# Altium project DPfinal.PrjPcb
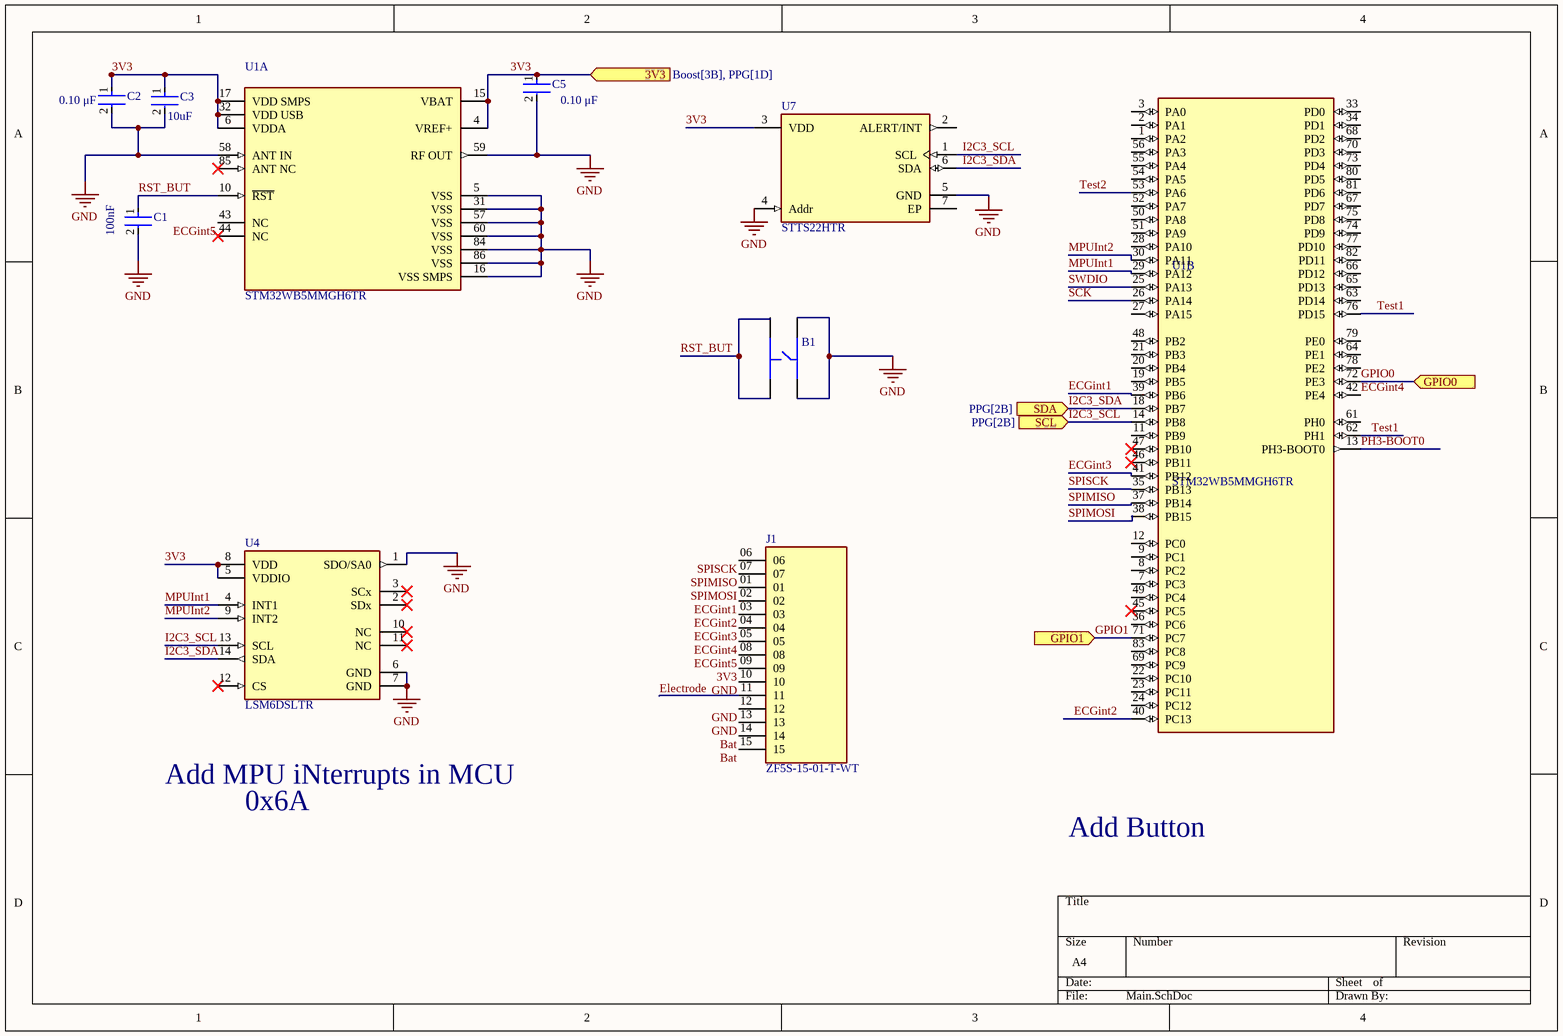
[diagram p0: Main.SchDoc]
3 sheets, 40 parts. Net scope: flat (ports and power ports of the same name join across sheets).
Board files: FinalPCB.PcbDoc, PCB1.PcbDoc
Sheets:
  Main.SchDoc
  PPG.SchDoc
  Boost.SchDoc

## Sheet Main.SchDoc
size A4; SheetNumber: 1; SheetTotal: 3

### Parts
B1  TS3425PA  [TS3425PA]  (value not drawn)
C1  value 100nF  [FP-GRM155-0_05-MFG]  (hidden comment: GRM155R71C104KA88J)
C2  Capacitance: 0.10 μF  [FP-C0402-BB-MFG]  (hidden comment: C0402C104K3RACTU)
C3  Capacitance: 10uF  [FP-CL10-IPC_A]  (hidden comment: CL10A106MA8NRNC)
C5  Capacitance: 0.10 μF  [FP-C0402-BB-MFG]  (hidden comment: C0402C104K3RACTU)
J1  ZF5S-15-01-T-WT  [ZF5S-15-01-T-WT]
U1  STM32WB5MMGH6TR  [STM32WB5MMGH6TR]  (parts A,B of 2)
U4  LSM6DSLTR  [FP-LGA-14L-DM00249496-MFG]
U7  STTS22HTR  [FP-UDFN-6L-DM00423052-MFG]

### Ports
3V3 (in, see Boost[3B], PPG[1D]), GPIO0 (in, see PPG[2C]), GPIO1 (in, see PPG[2C]), SCL (in, see PPG[2B]), SDA (in, see PPG[2B])

### Nets
GND: B1.3 B1.4 C1.2 C2.2 C3.2 C5.2 J1.10 J1.12 J1.13 U1.5(VSS) U1.16(VSS_SMPS) U1.31(VSS) U1.57(VSS) U1.58(ANT_IN) U1.59(RF_OUT) U1.60(VSS) U1.84(VSS) U1.86(VSS) U4.1(SDO/SA0) U4.6(GND) U4.7(GND) U7.4(Addr) U7.5(GND)
3V3: C2.1 C3.1 C5.1 J1.09 U1.4(VREF+) U1.6(VDDA) U1.15(VBAT) U1.17(VDD_SMPS) U1.32(VDD_USB) U4.5(VDDIO) U4.8(VDD) U7.3(VDD) ; port 3V3
Bat: J1.14 J1.15
ECGint1: J1.02 U1.39(PB6)
ECGint2: J1.03 U1.40(PC13)
ECGint3: J1.04 U1.41(PB12)
ECGint4: J1.05 U1.42(PE4)
ECGint5: J1.08 U1.43(NC)
Electrode: J1.11
GPIO0: U1.72(PE3) ; port GPIO0
GPIO1: U1.71(PC7) ; port GPIO1
I2C3_SCL: U1.14(PB8) U4.13(SCL) U7.1(SCL) ; port SCL
I2C3_SDA: U1.18(PB7) U4.14(SDA) U7.6(SDA) ; port SDA
MPUInt1: U1.29(PA12) U4.4(INT1)
MPUInt2: U1.30(PA11) U4.9(INT2)
PH3-BOOT0: U1.13(PH3-BOOT0)
RST_BUT: B1.1 C1.1 U1.10(~{RST})
SCK: U1.26(PA14)
SPIMISO: J1.07 U1.37(PB14)
SPIMOSI: J1.01
SPISCK: J1.06 U1.35(PB13)
SWDIO: U1.25(PA13)
Test1: U1.62(PH1) U1.76(PD15)
Test2: U1.53(PA6)

Not connected (* = marked no-connect by the designer): B1 2; U1 1(PA2) 2(PA1) 3(PA0) 7(PC3) 8(PC2) 9(PC1) 11(PB9) 12(PC0) 19(PB5) 20(PB4) 21(PB3) 22(PC10) 23(PC11) 24(PC12) 27(PA15) 28(PA10) 33(PD0) 34(PD1) 36(PC6) 38(PB15) 44(NC)* 45(PC5)* 46(PB11)* 47(PB10)* 48(PB2) 49(PC4) 50(PA8) 51(PA9) 52(PA7) 54(PA5) 55(PA4) 56(PA3) 61(PH0) 63(PD14) 64(PE1) 65(PD13) 66(PD12) 67(PD7) 68(PD2) 69(PC9) 70(PD3) 73(PD4) 74(PD9) 75(PD8) 77(PD10) 78(PE2) 79(PE0) 80(PD5) 81(PD6) 82(PD11) 83(PC8) 85(ANT_NC)*; U4 2(SDx)* 3(SCx)* 10(NC)* 11(NC)* 12(CS)*; U7 2(ALERT/INT) 7(EP)

### Notes on the sheet
- Add MPU iNterrupts in MCU
- 0x6A
- Add Button

### Library data of the parts
C1 = CMP-2008-03928-2: NexarPartId: 9223238; Manufacturer Lifecycle Status: NRND; Manufacturer: Murata; Voltage: 16V; Tolerance: 10%; Dielectric: X7R; Material: Ceramic; Schedule B: 8532240020, 8532240020; Mount: Surface Mount; Case/Package: 0402; Case Code (Imperial): 0402; Min Operating Temperature: -55°C; Length: 1mm; Voltage Rating (DC): 16V; Depth: 500µm; Lead Free: Lead Free; Max Operating Temperature: 125°C; Case Code (Metric): 1005; Radiation Hardening: No; Height: 550µm; Voltage Rating: 16V; Packaging: Cut Tape; RoHS: Compliant; Width: 500µm; Number of Pins: 2; REACH SVHC: No SVHC; Termination: SMD/SMT; Thickness: 500µm; Capacitance: 100nF; Supplier: Digikey; Supplier Part Number: 490-6328-1-ND; Manufacturer Part Number: GRM155R71C104KA88J; Category: Ceramic Capacitors; Stock: 17752595; Pricing: 1=0.08, 10=0.009, 50=0.0072, 100=0.0056, 500=0.0052, 1000=0.0048, 2500=0.004 (USD); Mounting Technology: Surface Mount; Pins: 2NUMBER; Package Quantity: 1; Series: GRM; Construction: Flat; Reach SVHC Compliant: No; RoHS Compliant: Yes; ComponentLink1URL: https://datasheet.ciiva.com/6271/product-6271168.pdf?src-supplier=Digikey; ComponentLink1Description: https://datasheet.ciiva.com/6271/product-6271168.pdf?src-supplier=Digikey; ComponentLink2URL: https://datasheet.ciiva.com/6271/grm155r71c104ka88-01-6271231.pdf?src-supplier=Digikey; ComponentLink2Description: https://datasheet.ciiva.com/6271/grm155r71c104ka88-01-6271231.pdf?src-supplier=Digikey
C2 C5 = CMP-03020-012858-1: Cap Ceramic 0.1uF 25V X7R 10% Pad SMD 0402 125C T/R; Manufacturer: Kemet; Value: 0.10 μF; Temperature Coefficient: 15%; Tolerance: 0.1; Dielectric Material: 4241ConductorMaterial; Temperature: -55°C to +125°C; Automotive: No; Height: 0.55mm; Package: C0402-BB; Category: Cap; Temperature Range Low: -55°C; Manufacturer Part Number: C0402C104K3RACTU; Device Class L2: Capacitors; Temperature Characteristic: X7R; Lead Free: Yes; Material: Ceramic; Mouser Description: Cap Ceramic 0.1uF 25V X7R 10% Pad SMD 0402 125C T/R; Temperature Range High: +125°C; Digikey Description: Cap Ceramic 0.1uF 25V X7R 10% Pad SMD 0402 125C T/R; Ipc Land Pattern Name: CAPC10050X50; Voltage Rating: 25 V; ComponentLink2URL: https://content.kemet.com/datasheets/KEM_C1002_X7R_SMD.pdf; Device Class L3: Ceramic Capacitors; RoHS: TRUE; Device Class L1: Passive Components; Octopart: https://octopart.com/c0402c104k3ractu-kemet-71105629; ComponentLink2Description: Datasheet; Supplier: Digikey; Supplier Part Number: 399-14148-1-ND; Stock: 453452; Pricing: 1=0.16, 10=0.095, 100=0.0611, 1000=0.04279, 2500=0.03794, 5000=0.0349 (USD); Case/Package: 0402; Pins: 2NUMBER; Case Code (Metric): 1005; Case Code (Imperial): 0402; Min Operating Temperature: -55°C; Max Operating Temperature: 125°C; Dielectric: X7R; Packaging: Cut Tape; Voltage Rating (DC): 25V; Reach SVHC Compliant: No; RoHS Compliant: Yes; ComponentLink1URL: http://www.farnell.com/datasheets/2746129.pdf?src-supplier=Farnell; ComponentLink1Description: http://www.farnell.com/datasheets/2746129.pdf?src-supplier=Farnell; ComponentLink3URL: http://www.farnell.com/datasheets/2746129.pdf?src-supplier=Newark; ComponentLink3Description: http://www.farnell.com/datasheets/2746129.pdf?src-supplier=Newark; ComponentLink4URL: http://www.farnell.com/datasheets/2746129.pdf?src-supplier=Element14; ComponentLink4Description: http://www.farnell.com/datasheets/2746129.pdf?src-supplier=Element14; ComponentLink5URL: https://datasheet.octopart.com/C0402C104K3RACTU-Kemet-datasheet-62095741.pdf?src-supplier=Element14; ComponentLink5Description: https://datasheet.octopart.com/C0402C104K3RACTU-Kemet-datasheet-62095741.pdf?src-supplier=Element14; ComponentLink6URL: https://api.kemet.com/component-edge/download/datasheet/C0402C104K3RAC7867.pdf?src-supplier=Digikey; ComponentLink6Description: https://api.kemet.com/component-edge/download/datasheet/C0402C104K3RAC7867.pdf?src-supplier=Digikey; ComponentLink7URL: https://datasheet.octopart.com/C0402C104K3RACTU-KEMET-datasheet-176289272.pdf?src-supplier=Newark; ComponentLink7Description: https://datasheet.octopart.com/C0402C104K3RACTU-KEMET-datasheet-176289272.pdf?src-supplier=Newark; ComponentLink8URL: https://datasheet.octopart.com/C0402C104K3RACTU-KEMET-datasheet-157246124.pdf?src-supplier=Electro+Sonic; ComponentLink8Description: https://datasheet.octopart.com/C0402C104K3RACTU-KEMET-datasheet-157246124.pdf?src-supplier=Electro+Sonic
C3 = CMP-13271-004224-1: Cap Ceramic 10uF 25V X5R ±20% Pad SMD 0603 +85°C T/R; Width: 0.031inch; Voltage Rating: 25V; Length: 0.063inch; Case Code (Metric): 1608; Dielectric: X5R; Termination: Wraparound; Lead Free: Lead Free; Mount: Surface Mount; Package Quantity: 1; Case Code (Imperial): 0603; Thickness: 0.035inch; Packaging: Tape and Reel; Contact Plating: Tin; Min Operating Temperature: -55°C; Tolerance: 20%; Max Operating Temperature: 85°C; Case/Package: 0603
J1 = ZF5S-15-01-T-WT: FFC & FPC Connectors Zero Insertion Force Connector for FFC, 0.50 mm (.0197) Pitch; Manufacturer: Samtec; Actuator Material: Polymer,Liquid Crystal Polymer; Actuator Color: Black; Wire/Cable Type: Straight; Number of Positions: 15; Max Current Rating: 1.4A; Pitch: 0.5mm; Supplier: Digikey; Supplier Part Number: SAM10388-ND; Manufacturer Part Number: ZF5S-15-01-T-WT; RoHS: Yes; Category: FFC / FPC; Stock: 265; Pricing: 1=2.37, 50=1.93, 100=1.64, 500=1.46, 1000=1.2763 (USD); Mounting Technology: Surface Mount; Contact Material: Bronze; Contact Plating: Tin; Housing Color: Natural; Housing Material: Polymer; Min Operating Temperature: -55°C; Max Operating Temperature: 105°C; Packaging: Rail/Tube; Termination: Solder; Series: ZF5S; Number of Rows: 1; Number of Contacts: 15; Orientation: Right Angle; Length: 13.15mm; Depth: 5.66mm; Radiation Hardening: No; RoHS Compliant: Yes; ComponentLink1URL: http://www.farnell.com/datasheets/2607237.pdf?src-supplier=Farnell; ComponentLink1Description: http://www.farnell.com/datasheets/2607237.pdf?src-supplier=Farnell; ComponentLink2URL: http://components.arrow.com/part/dataview/51417210S9388675N1004?src-supplier=Arrow+Electronics; ComponentLink2Description: http://components.arrow.com/part/dataview/51417210S9388675N1004?src-supplier=Arrow+Electronics; ComponentLink3URL: http://www.farnell.com/datasheets/2607237.pdf?src-supplier=Newark; ComponentLink3Description: http://www.farnell.com/datasheets/2607237.pdf?src-supplier=Newark; ComponentLink4URL: http://www.samtec.com/documents/webfiles/pdf/zf5s.pdf?src-supplier=Avnet; ComponentLink4Description: http://www.samtec.com/documents/webfiles/pdf/zf5s.pdf?src-supplier=Avnet; ComponentLink5URL: http://suddendocs.samtec.com/prints/zf5s-xx-xx-x-wt-x-xx-mkt.pdf?src-supplier=Digikey; ComponentLink5Description: http://suddendocs.samtec.com/prints/zf5s-xx-xx-x-wt-x-xx-mkt.pdf?src-supplier=Digikey; Supplier 1: Digikey; Supplier Part Number 1: SAM10388-ND
U1 = STM32WB5MMGH6TR: RISC Microcontroller, 32-Bit, FLASH, CORTEX-M4F CPU, 180MHz, CMOS, PBGA216; Manufacturer: STMicroelectronics; Interface: 39,40,224,1519,1532,1533,4268Interface; Data Rate: 2Mbps; Clock Frequency: 2.4GHz; Max Supply Voltage: 3.6V; Min Supply Voltage: 1.71V; Number of GPIO: 68NUMBER; Supplier: Digikey; Supplier Part Number: 497-STM32WB5MMGH6CT-ND; Manufacturer Part Number: STM32WB5MMGH6TR; RoHS: No; Category: Microcontrollers; Stock: 5514; Pricing: 1=12.14, 10=9.532, 25=8.8804, 100=8.1641, 250=7.8228, 500=7.61702 (USD); Min Operating Temperature: -40°C; Max Operating Temperature: 85°C; Height: 1.428mm; Supplier 1: Digikey; Supplier Part Number 1: 497-STM32WB5MMGH6CT-ND
U4 = CMP-2000-07467-2: IMU ACCEL/GYRO I2C/SPI 14LGA; Manufacturer: STMicroelectronics; Resolution: 16bits; Max Supply Voltage: 3.6V; Sensor Type: Temperature,Accelerometer,Gyroscope; Sensor Output: I2C,SPI; Gyro Range: 125/250/500/1000/2000°/s; Accel Range: 2/4/8/16g; Operating Supply Current: 0.29-0.65mA; Min Supply Voltage: 1.62V; Package: LGA-14L-DM00249496; Temperature Range High: +85°C; Automotive: No; Footprint Url: https://www.st.com/resource/en/technical_note/cd00134799.pdf; Height: 0.86mm; Device Class L1: Sensors; Octopart: https://octopart.com/lsm6dsltr-stmicroelectronics-66358193; Device Class L2: Motion Sensors; Lead Free: Yes; Category: IC; Device Class L3: Inertial Measurement Units (IMUs); ComponentLink2Description: Datasheet; RoHS: TRUE; ComponentLink2URL: https://www.st.com/resource/en/datasheet/lsm6dsl.pdf; Temperature Range Low: -40°C; Manufacturer Part Number: LSM6DSLTR; Mouser Description: iNEMO inertial module: always-on 3D accelerometer and 3D gyroscope; Digikey Description: IMU ACCEL/GYRO I2C/SPI 14LGA; Temperature: -40°C to +85°C
U7 = CMP-12184-000002-1: LOW-VOLTAGE, ULTRA-LOW-POWER, 0.; Manufacturer: STMicroelectronics; Max Supply Voltage: 3.6V; Sensor Output: I2C,SMBus; Min Supply Voltage: 1.5V; Resolution: 16bits; Standoff Height: 0mm; Operating Supply Current: 1.75-120uA; Octopart: https://octopart.com/stts22htr-stmicroelectronics-103417944; Temperature: -40°C to +125°C; Interface: I2C,SMBus; ComponentLink2Description: Datasheet; Device Class L3: unset; Lead Free: Yes; Temperature Range Low: -40°C; ComponentLink2URL: https://www.st.com/resource/en/datasheet/stts22h.pdf; Temperature Range High: +125°C; RoHS: TRUE; Automotive: No; Device Class L1: Sensors; Category: IC; Manufacturer Part Number: STTS22HTR; Package: UDFN-6L-DM00423052; Device Class L2: Temperature and Humidity Sensors; Mouser Description: Low-voltage, ultra-low-power, 0.5 ï¿½C accuracy Iï¿½C/SMBus 3.0 temperature sensor; Digikey Description: LOW-VOLTAGE, ULTRA-LOW-POWER, 0.; Height: 0.55mm

## Sheet PPG.SchDoc
size A4; SheetNumber: 2; SheetTotal: 3; SPICEModelCacheSGABUIPG: <root> / <DocumentId>SGABUIPG</DocumentId> / </root>
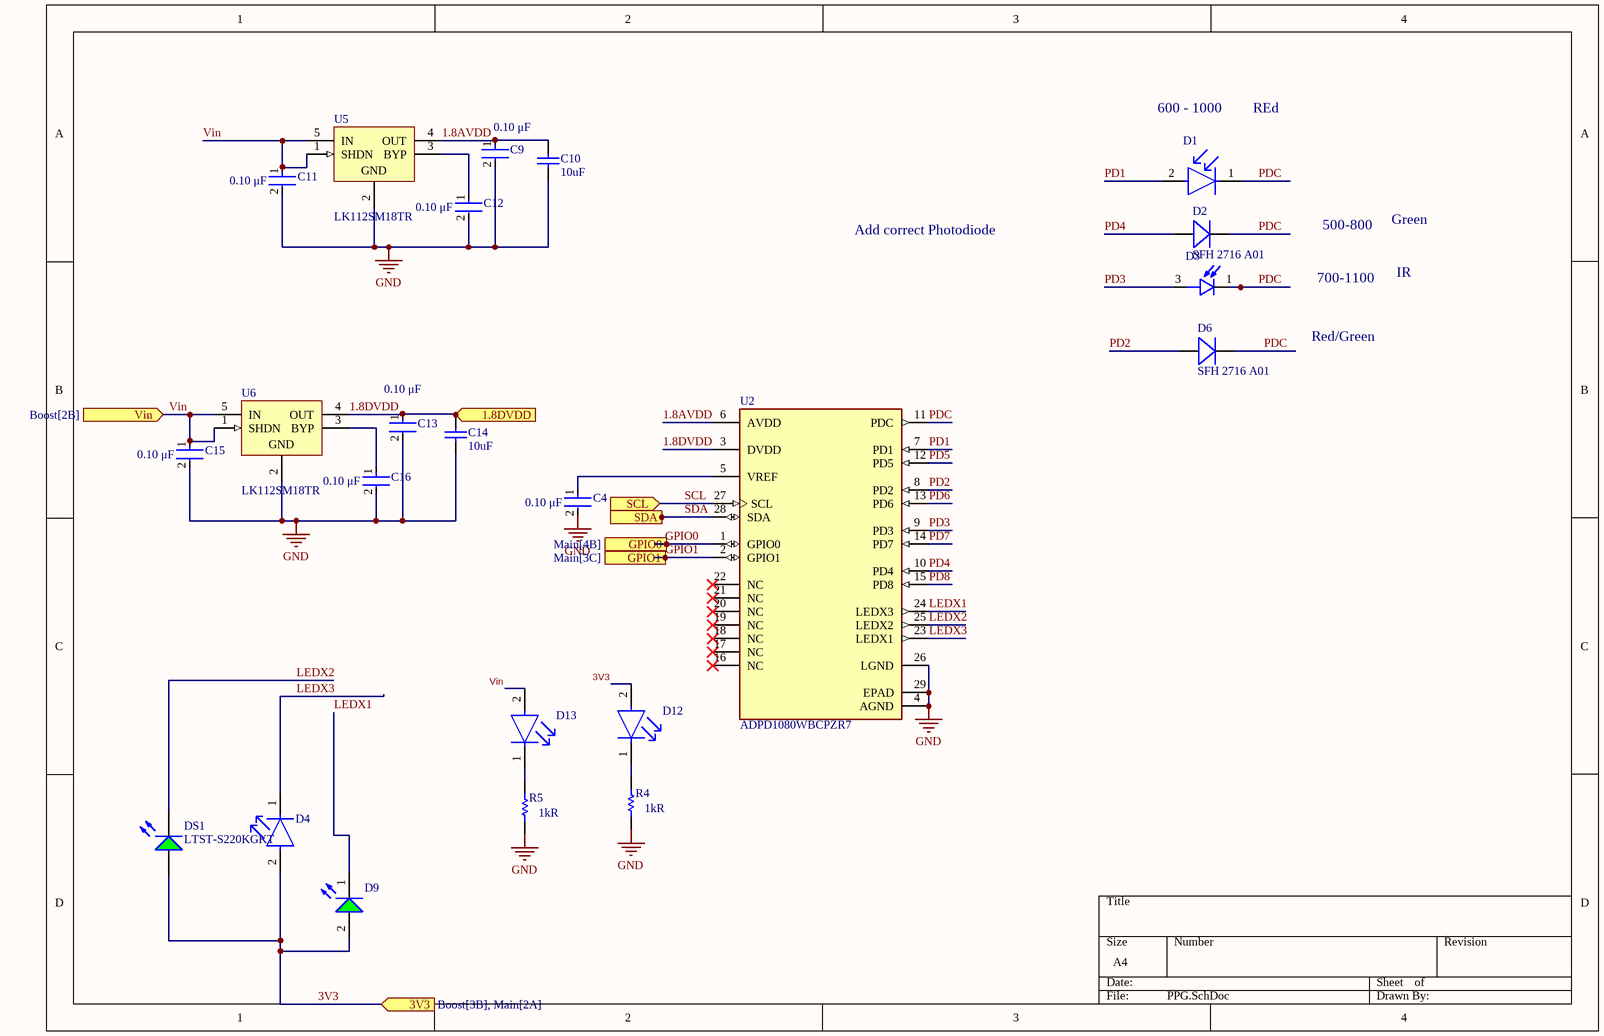
[diagram p1: PPG.SchDoc]

### Parts
C4  Capacitance: 0.10 μF  [FP-C0402-BB-MFG]  (hidden comment: C0402C104K3RACTU)
C9  Capacitance: 0.10 μF  [FP-C0402-BB-MFG]  (hidden comment: C0402C104K3RACTU)
C10  value 10uF  (hidden comment: Capacitor)
C11  Capacitance: 0.10 μF  [FP-C0402-BB-MFG]  (hidden comment: C0402C104K3RACTU)
C12  Capacitance: 0.10 μF  [FP-C0402-BB-MFG]  (hidden comment: C0402C104K3RACTU)
C13  Capacitance: 0.10 μF  [FP-C0402-BB-MFG]  (hidden comment: C0402C104K3RACTU)
C14  value 10uF  (hidden comment: Capacitor)
C15  Capacitance: 0.10 μF  [FP-C0402-BB-MFG]  (hidden comment: C0402C104K3RACTU)
C16  Capacitance: 0.10 μF  [FP-C0402-BB-MFG]  (hidden comment: C0402C104K3RACTU)
D1  SFH 2704  [FP-SFH_2704-MFG]  (value not drawn)
D2  SFH 2716 A01  [SFH 2716 A01]
D3  SFH 2400 FA  [SFH 2400 FA]  (value not drawn)
D4  LS R976-NR-1  [FP-LS_R976-MFG]  (value not drawn)
D6  SFH 2716 A01  [SFH 2716 A01]
D9  150141GS73100  [WL-SMTW_3528]  (value not drawn)
D12  LTST-S270KRKT  [FP-LTST-S270KRKT-MFG]  (value not drawn)
D13  LTST-S270KRKT  [FP-LTST-S270KRKT-MFG]  (value not drawn)
DS1  LTST-S220KGKT  [LTST-S220KGKT_V]
R4  value 1kR  [RESC1005X40X25LL10T10]  (hidden comment: RK73H1ETTP1001F)
R5  value 1kR  [RESC1005X40X25LL10T10]  (hidden comment: RK73H1ETTP1001F)
U2  ADPD1080WBCPZR7  [ADPD1080WBCPZR7]
U5  LK112SM18TR  [SOT23-5L_M]
U6  LK112SM18TR  [SOT23-5L_M]

### Ports
1.8DVDD (in), 3V3 (in, see Boost[3B], Main[2A]), GPIO0 (in, see Main[4B]), GPIO1 (in, see Main[3C]), SCL (in, see Main[3B]), SDA (in, see Main[3B]), Vin (in, see Boost[2B])

### Nets
GND: C4.2 C9.2 C10.1 C11.2 C12.2 C13.2 C14.1 C15.2 C16.2 R4.1 R5.1 U2.4(AGND) U2.26(LGND) U2.29(EPAD) U5.2(GND) U6.2(GND)
1.8AVDD: C9.1 C10.2 U2.6(AVDD) U5.4(OUT)
1.8DVDD: C13.1 C14.2 U2.3(DVDD) U6.4(OUT) ; port 1.8DVDD
3V3: D4.2(A) D9.2(A) D12.2(A) DS1.1(A) ; port 3V3
GPIO0: U2.1(GPIO0) ; port GPIO0
GPIO1: U2.2(GPIO1) ; port GPIO1
LEDX1: D9.1(K) U2.24(LEDX3)
LEDX2: DS1.2(K) U2.25(LEDX2)
LEDX3: D4.1(C) U2.23(LEDX1)
PD1: D1.2(A) U2.7(PD1)
PD2: D6.A U2.8(PD2)
PD3: D3.3(A) U2.9(PD3)
PD4: D2.A U2.10(PD4)
PD5: U2.12(PD5)
PD6: U2.13(PD6)
PD7: U2.14(PD7)
PD8: U2.15(PD8)
PDC: D1.1(C) D2.K D3.1(C) D6.K U2.11(PDC)
SCL: U2.27(SCL) ; port SCL  [project net I2C3_SCL]
SDA: U2.28(SDA) ; port SDA  [project net I2C3_SDA]
Vin: C11.1 C15.1 D13.2(A) U5.1(SHDN) U5.5(IN) U6.1(SHDN) U6.5(IN) ; port Vin
NetC4_1: C4.1 U2.5(VREF)
NetC12_1: C12.1 U5.3(BYP)
NetC16_1: C16.1 U6.3(BYP)
NetD12_1: D12.1(C) R4.2
NetD13_1: D13.1(C) R5.2

Not connected (* = marked no-connect by the designer): U2 16(NC)* 17(NC)* 18(NC)* 19(NC)* 20(NC)* 21(NC)* 22(NC)*

### Notes on the sheet
- 600 - 1000
- REd
- Add correct Photodiode
- 500-800
- Green
- 700-1100
- IR
- Red/Green

### Library data of the parts
C4 C9 C11-C13 C15 C16 = CMP-03020-012858-1: as C2 on sheet Main; Temperature: -55°C to +125°C; Automotive: No; Height: 0.55mm; Package: C0402-BB; Category: Cap; Temperature Range Low: -55°C; Manufacturer Part Number: C0402C104K3RACTU; Device Class L2: Capacitors; Temperature Characteristic: X7R; Lead Free: Yes; Material: Ceramic; Mouser Description: Cap Ceramic 0.1uF 25V X7R 10% Pad SMD 0402 125C T/R; Temperature Range High: +125°C; Digikey Description: Cap Ceramic 0.1uF 25V X7R 10% Pad SMD 0402 125C T/R; Ipc Land Pattern Name: CAPC10050X50; Voltage Rating: 25 V; ComponentLink2URL: https://content.kemet.com/datasheets/KEM_C1002_X7R_SMD.pdf; Device Class L3: Ceramic Capacitors; RoHS: TRUE; Device Class L1: Passive Components; Octopart: https://octopart.com/c0402c104k3ractu-kemet-71105629; ComponentLink2Description: Datasheet; Supplier: Digikey; Supplier Part Number: 399-14148-1-ND; Stock: 453452; Pricing: 1=0.16, 10=0.095, 100=0.0611, 1000=0.04279, 2500=0.03794, 5000=0.0349 (USD); Case/Package: 0402; Pins: 2NUMBER; Case Code (Metric): 1005; Case Code (Imperial): 0402; Min Operating Temperature: -55°C; Max Operating Temperature: 125°C; Dielectric: X7R; Packaging: Cut Tape; Voltage Rating (DC): 25V; Reach SVHC Compliant: No; RoHS Compliant: Yes; ComponentLink1URL: http://www.farnell.com/datasheets/2746129.pdf?src-supplier=Farnell; ComponentLink1Description: http://www.farnell.com/datasheets/2746129.pdf?src-supplier=Farnell; ComponentLink3URL: http://www.farnell.com/datasheets/2746129.pdf?src-supplier=Newark; ComponentLink3Description: http://www.farnell.com/datasheets/2746129.pdf?src-supplier=Newark; ComponentLink4URL: http://www.farnell.com/datasheets/2746129.pdf?src-supplier=Element14; ComponentLink4Description: http://www.farnell.com/datasheets/2746129.pdf?src-supplier=Element14; ComponentLink5URL: https://datasheet.octopart.com/C0402C104K3RACTU-Kemet-datasheet-62095741.pdf?src-supplier=Element14; ComponentLink5Description: https://datasheet.octopart.com/C0402C104K3RACTU-Kemet-datasheet-62095741.pdf?src-supplier=Element14; ComponentLink6URL: https://api.kemet.com/component-edge/download/datasheet/C0402C104K3RAC7867.pdf?src-supplier=Digikey; ComponentLink6Description: https://api.kemet.com/component-edge/download/datasheet/C0402C104K3RAC7867.pdf?src-supplier=Digikey; ComponentLink7URL: https://datasheet.octopart.com/C0402C104K3RACTU-KEMET-datasheet-176289272.pdf?src-supplier=Newark; ComponentLink7Description: https://datasheet.octopart.com/C0402C104K3RACTU-KEMET-datasheet-176289272.pdf?src-supplier=Newark; ComponentLink8URL: https://datasheet.octopart.com/C0402C104K3RACTU-KEMET-datasheet-157246124.pdf?src-supplier=Electro+Sonic; ComponentLink8Description: https://datasheet.octopart.com/C0402C104K3RACTU-KEMET-datasheet-157246124.pdf?src-supplier=Electro+Sonic
C10 C14 = Capacitor: CL10 Series 0603 10 uF 16 V ±20% Tolerance X5R Multilayer Ceramic Chip Capacitor; Manufacturer: Samsung; Manufacturer Part Number: CL10A106MO8NQNC; SimulationGenericComponent: True; Supplier: Mouser; Supplier Part Number: 187-CL10A106MO8NQNC; RoHS: Yes; Category: Ceramic Capacitors; Stock: 15386; Pricing: 1=0.3, 10=0.167, 50=0.167, 100=0.098, 1000=0.066, 10000=0.047 (USD); Lead Free: 5697LeadFree; ComponentLink1URL: https://datasheet.ciiva.com/25711/cl10a106mo8nqnc-25711536.pdf?src-supplier=Digikey; ComponentLink1Description: https://datasheet.ciiva.com/25711/cl10a106mo8nqnc-25711536.pdf?src-supplier=Digikey; ComponentLink2URL: https://datasheet.ciiva.com/26838/getdatasheetpartid-746571-26838345.pdf?src-supplier=Verical; ComponentLink2Description: https://datasheet.ciiva.com/26838/getdatasheetpartid-746571-26838345.pdf?src-supplier=Verical; ComponentLink3URL: https://datasheet.ciiva.com/29198/457342-da-01-en-vs-kondensator-0603-29198787.pdf?src-supplier=Conrad; ComponentLink3Description: https://datasheet.ciiva.com/29198/457342-da-01-en-vs-kondensator-0603-29198787.pdf?src-supplier=Conrad
D1 = CMP-62027-000006-1: SENSOR PHOTODIODE 900NM 2SMD; Manufacturer: Osram Opto; Viewing Angle: 120°; Dark Current: 100pA; Diode Type: PIN; Response Time: 67ns; Max Reverse Voltage (DC): 6V; RoHS Compliant: Yes; Supplier: Digikey; Supplier Part Number: 475-SFH2704CT-ND; Manufacturer Part Number: SFH 2704; RoHS: Yes; Category: Photodiodes; Stock: 4566; Pricing: 1=0.83, 10=0.576, 100=0.4218, 500=0.35302, 1000=0.33048 (USD); Mounting Technology: Surface Mount; Case/Package: SMD/SMT; Min Operating Temperature: -40°C; Max Operating Temperature: 85°C; Series: CHipLED; Packaging: Cut Tape; Wavelength: 900nm; ComponentLink1URL: https://media.digikey.com/pdf/Data%20Sheets/Osram%20PDFs/SFH_2704_v0.0_9-12-18.pdf?src-supplier=Digikey; ComponentLink1Description: https://media.digikey.com/pdf/Data%20Sheets/Osram%20PDFs/SFH_2704_v0.0_9-12-18.pdf?src-supplier=Digikey; ComponentLink2URL: http://datasheet.octopart.com/SFH-2704-Osram-Opto-datasheet-142374394.pdf?src-supplier=Rs; ComponentLink2Description: http://datasheet.octopart.com/SFH-2704-Osram-Opto-datasheet-142374394.pdf?src-supplier=Rs
D2 D6 = SFH 2716 A01: Silicon PIN Photodiode with Vλ Characteristics, -40 to 100 °C, 1.3 x 2 x 0.8 mm; Manufacturer: Osram Opto; Supplier: DigiKey; Supplier Part Number: 475-SFH2716A01CT-ND; Manufacturer Part Number: SFH 2716 A01; RoHS: Yes; Category: Phototransistor; Stock: 7067; Pricing: 1=1.01, 10=0.615, 100=0.4162, 500=0.33804, 1000=0.31406 (USD); Supplier 1: Digikey; Supplier Part Number 1: 475-SFH2716A01DKR-ND
D4 = CMP-62016-000037-1: LED RED DIFFUSED 0805 SMD; Lens Size: 1.25mm; Number of LEDs: 1; Luminous Intensity: 180mcd; Dominant Wavelength: 633nm; Lens Style: Flat; Reverse Voltage: 12V; Lens Color: White; Forward Voltage: 2.5V; Forward Current: 25mA; Power Dissipation: 65W; Luminous Flux: 0.47lm; Test Current: 20mA; Viewing Angle: 160°; Length: 2mm; Number of Pins: 2; Lens Transparency: Diffused; Min Operating Temperature: -30°C; Case Code (Metric): 2012; Depth: 1.35mm; Color: Red; Illumination Color: Red; Max Operating Temperature: 85°C; Mount: Surface Mount; Case/Package: 0805; Height: 0.9mm; Package Quantity: 16000; Number of Elements: 1; Radiation Hardening: No; Case Code (Imperial): 0805; Packaging: Tape and Reel; Width: 1.25mm
D9 = CMP-1429-00004-2: NexarPartId: 29717794; Manufacturer: Wurth Electronics; Forward Current: 100mA; Lens Style: Clear, Round; Color: Green; Wavelength: 525nm; Peak Wavelength: 515nm; Luminous Intensity: 1cd; Forward Voltage: 3.1V; Viewing Angle: 120°; Test Current: 20mA; Max Reverse Voltage (DC): 5V; Power Dissipation: 105mW; Lens Color: Colorless; Lens Transparency: Clear; Lens Size: 2.4mm; Mount: Surface Mount; Max Operating Temperature: 85°C; Min Operating Temperature: -40°C; Lead Free: Lead Free; Width: 2.8mm; Case Code (Imperial): 1411; REACH SVHC: Unknown; RoHS: Compliant; Packaging: Tape and Reel; Length: 3.5mm; Dominant Wavelength: 525nm; Height: 1.9mm; Case/Package: 3528; Reverse Voltage: 5V; Case Code (Metric): 3528; Supplier: Digikey; Supplier Part Number: 732-4997-1-ND; Manufacturer Part Number: 150141GS73100; Category: LEDs; Stock: 36143; Pricing: 1=0.17, 50=0.1684, 100=0.1467, 500=0.115 (USD); Mounting Technology: Surface Mount; Package Quantity: 1; Series: WL-SMTW; RoHS Compliant: Yes; Reach SVHC Compliant: Unknown; ComponentLink1URL: https://datasheet.ciiva.com/23843/150141gs73100-23843266.pdf?src-supplier=Newark; ComponentLink1Description: https://datasheet.ciiva.com/23843/150141gs73100-23843266.pdf?src-supplier=Newark; ComponentLink2URL: https://datasheet.ciiva.com/29278/759463-da-01-en-smd-topled-einf-gruen-150141gs73100-29278953.pdf?src-supplier=Conrad; ComponentLink2Description: https://datasheet.ciiva.com/29278/759463-da-01-en-smd-topled-einf-gruen-150141gs73100-29278953.pdf?src-supplier=Conrad; ComponentLink3URL: https://datasheet.ciiva.com/22656/1911484-22656997.pdf?src-supplier=Element14; ComponentLink3Description: https://datasheet.ciiva.com/22656/1911484-22656997.pdf?src-supplier=Element14; ComponentLink4URL: https://datasheet.ciiva.com/48430/150141gs73100-eng-tds-48430060.pdf?src-supplier=Distrelec; ComponentLink4Description: https://datasheet.ciiva.com/48430/150141gs73100-eng-tds-48430060.pdf?src-supplier=Distrelec; ComponentLink5URL: https://datasheet.ciiva.com/29563/150141gs73100-29563029.pdf?src-supplier=Digikey; ComponentLink5Description: https://datasheet.ciiva.com/29563/150141gs73100-29563029.pdf?src-supplier=Digikey; ComponentLink6URL: https://datasheet.ciiva.com/29563/150141gs73100-29563030.pdf?src-supplier=Digikey; ComponentLink6Description: https://datasheet.ciiva.com/29563/150141gs73100-29563030.pdf?src-supplier=Digikey
D12 D13 = CMP-2000-06630-2: LED RED CLEAR CHIP SMD R/A; Manufacturer: Vishay Lite-On; Test Current: 20mA; Number of LEDs: 1; Power Rating: 75mW; Lens Style: Diffused; Luminous Intensity: 54mcd; Wavelength: 639nm; Dominant Wavelength: 631nm; Lens Color: Colorless; Forward Voltage: 2V; Viewing Angle: 130°; Forward Current: 30mA; Reverse Voltage: 5V; Lens Size: 0.6mm; Illumination Color: Red; Case Code (Imperial): 0603; Color: Red; Packaging: Tape and Reel; Number of Pins: 2; Length: 1.6mm; Lens Transparency: Clear; Width: 1.15mm; Power Dissipation: 75mW; Lead Free: Lead Free; Max Power Dissipation: 75mW; Case/Package: 0603; Max Operating Temperature: 85°C; Mount: Surface Mount; Depth: 0.6mm; Number of Elements: 1; Radiation Hardening: No; Case Code (Metric): 1608; Package Quantity: 1; Height: 0.6mm; Min Operating Temperature: -55°C; Supplier: Digikey; Supplier Part Number: 160-1479-1-ND; Manufacturer Part Number: LTST-S270KRKT; RoHS: Yes; Category: LEDs; Stock: 83540; Pricing: 1=0.24, 10=0.133, 100=0.0617, 500=0.05696, 1000=0.04462, 2000=0.04367 (USD); Mounting Technology: Surface Mount; Pins: 2; Series: -; RoHS Compliant: Yes; ComponentLink1URL: https://datasheet.ciiva.com/11775/0900766b80dc0b8e-11775445.pdf?src-supplier=Rs; ComponentLink1Description: https://datasheet.ciiva.com/11775/0900766b80dc0b8e-11775445.pdf?src-supplier=Rs; ComponentLink2URL: https://datasheet.ciiva.com/12400/ltst-s270krkt-201849-12400833.pdf?src-supplier=Mouser; ComponentLink2Description: https://datasheet.ciiva.com/12400/ltst-s270krkt-201849-12400833.pdf?src-supplier=Mouser; ComponentLink3URL: https://datasheet.ciiva.com/2110/ltst-s270krkt-2110021.pdf?src-supplier=Digikey; ComponentLink3Description: https://datasheet.ciiva.com/2110/ltst-s270krkt-2110021.pdf?src-supplier=Digikey; ComponentLink4URL: https://datasheet.ciiva.com/16387/p-100-ltst-s270krkt-16387507.pdf?src-supplier=Future+Electronics; ComponentLink4Description: https://datasheet.ciiva.com/16387/p-100-ltst-s270krkt-16387507.pdf?src-supplier=Future+Electronics; ComponentLink5URL: https://datasheet.ciiva.com/2110/s-110-ltst-s270krkt-2110023.pdf?src-supplier=Digikey; ComponentLink5Description: https://datasheet.ciiva.com/2110/s-110-ltst-s270krkt-2110023.pdf?src-supplier=Digikey; ComponentLink6URL: https://datasheet.ciiva.com/2110/s-110-ltst-s270krkt-2110022.pdf?src-supplier=Digikey; ComponentLink6Description: https://datasheet.ciiva.com/2110/s-110-ltst-s270krkt-2110022.pdf?src-supplier=Digikey
DS1 = CMP-2000-06628-1: LED Green, 75 mW, 30 mA, -30 to 85 degC, 2-Pin SMD, RoHS, Tape and Reel; Manufacturer: Lite-On; Chip Material: AlGaInP; Lum Intensity: 35mcd; Rad Hardened: No; Number of  Elements: 1; Forward Current: 30mA; Power Dissipation: 75W; Reverse Voltage: 5V; High Brightness: Yes; Test Current (It): 20mA; Dominant Wave Length: 571nm; Emitting Color: YellowGreen; Product Length (mm): 2.1mm; Peak Wavelength: 574nm; Product Depth (mm): 0.6mm; Type: Uni-Color; Main Category: ChipLED; Shape Type: Rectangular; DELETED: Compliant; Forward Voltage: 2.4V; Viewing Angle: 130deg; Product Height (mm): 1mm; Package Reference: S220KGKT; Operating Temp Range: -55Cto85C; Lens Dimensions: 1.7x0.6x0.5mm; Manufacturer URL: http://www.us.liteon.com/; Luminous Intensity: 35mcd; Datasheet URL: http://optoelectronics.liteon.com/upload/download/DS22-2000-075/S_110_LTST-S220KGKT.pdf; Package Type: ChipLed; Packaging: TapeandReel; Mounting Technology: SurfaceMount; Mounting: SurfaceMount; Operating Temperature Classification: Industrial; Package Description: 2-Pin Surface Mount Device, Body 2.15 x 0.6 mm; Datasheet Version: Rev. D, 12/2013; Pin Count: 2
R4 R5 = CMP-2002-03808-1: Manufacturer: KOA Speer; Tolerance: 1%; Power Rating: 63mW; Voltage Rating: 50V; Temperature Coefficient: 100ppm/°C; Max Power Dissipation: 100mW; Part Number: RK73H1ETTP1001F; Supplier: Digikey; Supplier Part Number: 2019-RK73H1ETTP1001FCT-ND; Manufacturer Part Number: RK73H1ETTP1001F; RoHS: Yes; Category: Chip SMD Resistors; Stock: 1021606; Pricing: 1=0.1, 10=0.021, 50=0.0134, 100=0.0112, 500=0.00764, 1000=0.00658, 5000=0.00478 (USD); Mounting Technology: Surface Mount; Case/Package: 0402; Case Code (Imperial): 0402; Case Code (Metric): 1005; Min Operating Temperature: -55°C; Max Operating Temperature: 155°C; Packaging: Tape and Reel; Package Quantity: 10000; Termination: SMD/SMT; Series: RK73H; Construction: Rectangular; Technology: THICK FILM; Features: Moisture Resistant,Automotive AEC-Q200; Number of Terminations: 2; Voltage Rating (DC): 50V; Length: 1mm; Width: 0.5mm; Height: 0.35mm; Depth: 0.5mm; Ratings: AEC-Q200; Military Standard: Not; RoHS Compliant: Yes; Lead Free: 5697LeadFree; ComponentLink1URL: https://datasheet.ciiva.com/5554/rk73h-5554172.pdf?src-supplier=Mouser; ComponentLink1Description: https://datasheet.ciiva.com/5554/rk73h-5554172.pdf?src-supplier=Mouser
U2 = ADPD1080WBCPZR7: Optical Afe For Health Monitorin; Supplier 1: Digikey; Supplier Part Number 1: 505-ADPD1080WBCPZR7CT-ND
U5 U6 = CMP-0244-00332-1: 200mA, Low Noise Low Drop Voltage Regulator with Shutdown Function, 1.8V, 5-Pin SOT23-5L, Tape and Reel; Manufacturer: STMicroelectronics; ComponentLink1Description: Manufacturer URL; ComponentLink1URL: http://www.st.com; ComponentLink2Description: Datasheet; PackageReference: SOT23-5L; DatasheetVersion: 10/07/2008; PackageDescription: 5-Pin SOT-23 Package, 2.9 x 1.6 mm Body, 0.95 mm Pitch, 2.8 mm Lead Span; PackageVersion: 1/01/2008; ComponentLink2URL: http://www.st.com/internet/com/TECHNICAL_RESOURCES/TECHNICAL_LITERATURE/DATASHEET/CD00002558.pdf; Supplier: Digikey; Supplier Part Number: 497-7811-1-ND; Manufacturer Part Number: LK112SM18TR; RoHS: Yes; Category: Voltage Regulators - Linear; Stock: 1322; Pricing: 1=0.91, 10=0.653, 25=0.588, 100=0.5172, 250=0.4834, 500=0.46302, 1000=0.44623 (USD); ComponentLink3URL: https://datasheet.ciiva.com/3225/cd00002558-3225210.pdf?src-supplier=Avnet; ComponentLink3Description: https://datasheet.ciiva.com/3225/cd00002558-3225210.pdf?src-supplier=Avnet; ComponentLink4URL: https://datasheet.ciiva.com/2042/cd00002558-2042967.pdf?src-supplier=Digikey; ComponentLink4Description: https://datasheet.ciiva.com/2042/cd00002558-2042967.pdf?src-supplier=Digikey; ComponentLink5URL: https://datasheet.ciiva.com/2042/cd00002558-2042968.pdf?src-supplier=Digikey; ComponentLink5Description: https://datasheet.ciiva.com/2042/cd00002558-2042968.pdf?src-supplier=Digikey; ComponentLink6URL: https://datasheet.ciiva.com/2042/cd00002558-2042969.pdf?src-supplier=Digikey; ComponentLink6Description: https://datasheet.ciiva.com/2042/cd00002558-2042969.pdf?src-supplier=Digikey

## Sheet Boost.SchDoc
size A4; SheetNumber: 3; SheetTotal: 3
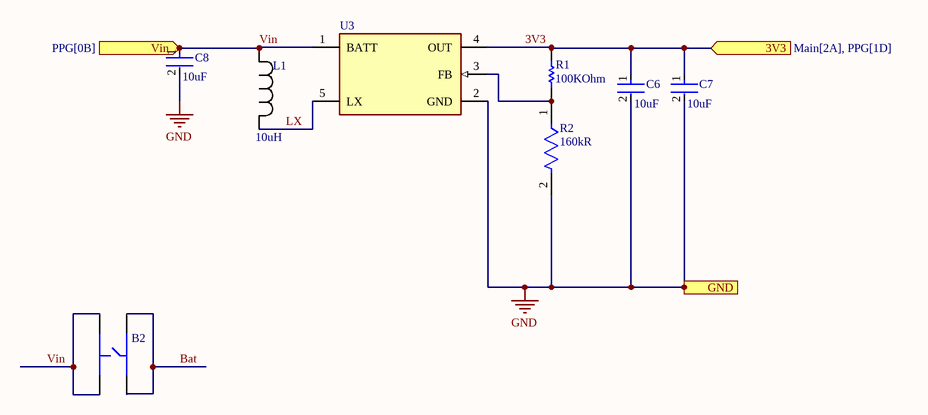
[diagram p2: Boost.SchDoc]

### Parts
B2  TS3425PA  [TS3425PA]  (value not drawn)
C6  Capacitance: 10uF  [FP-CL10-IPC_A]  (hidden comment: CL10A106MA8NRNC)
C7  Capacitance: 10uF  [FP-CL10-IPC_A]  (hidden comment: CL10A106MA8NRNC)
C8  Capacitance: 10uF  [FP-CL10-IPC_A]  (hidden comment: CL10A106MA8NRNC)
L1  value 10uH  [SWPA6028S100MT]  (hidden comment: SWPA6028S100MT)
R1  Resistance: 100KOhm  [RESC3116X65X40ML10T20]  (hidden comment: RC1206FR-07100KL)
R2  Resistance: 160kR  [FP-AC0402-IPC_B]  (hidden comment: AC0402FR-07160KL)
U3  MAX1722EZK+T  [FP-Z5-1-IPC_A]  (value not drawn)

### Ports
3V3 (in, see Main[2A], PPG[1D]), GND (in), Vin (in, see PPG[0B])

### Nets
GND: C6.2 C7.2 C8.2 R2.2 U3.2(GND) ; port GND
3V3: C6.1 C7.1 R1.2 U3.4(OUT) ; port 3V3
Bat: B2.3 B2.4
LX: L1.1 U3.5(LX)
Vin: B2.1 B2.2 C8.1 L1.2 U3.1(BATT) ; port Vin
NetR1_1: R1.1 R2.1 U3.3(FB)

### Library data of the parts
C6-C8 = CMP-13271-004224-1: as C3 on sheet Main; Width: 0.031inch; Voltage Rating: 25V; Length: 0.063inch; Case Code (Metric): 1608; Dielectric: X5R; Termination: Wraparound; Lead Free: Lead Free; Mount: Surface Mount; Package Quantity: 1; Case Code (Imperial): 0603; Thickness: 0.035inch; Packaging: Tape and Reel; Contact Plating: Tin; Min Operating Temperature: -55°C; Tolerance: 20%; Max Operating Temperature: 85°C; Case/Package: 0603
L1 = SWPA6028S100MT: 6.0x6.0x2.8 10uH ±20% DCR=94mΩ 1.95A SRF=23MHz 应用:电源; Manufacturer: Sunlord; Supplier: Digikey; Supplier Part Number: 3442-SWPA6028S100MTCT-ND; Manufacturer Part Number: SWPA6028S100MT; RoHS: No; Stock: 912; Pricing: 1=0.69, 10=0.571, 100=0.4693, 1000=0.38596 (USD); Supplier 1: Digikey; Supplier Part Number 1: 3442-SWPA6028S100MTDKR-ND
R1 = CMP-2100-03674-1: Chip Resistor, 100 KOhm, +/- 1%, 0.25 W, -55 to 155 degC, 1206 (3216 Metric), RoHS, Tape and Reel; Manufacturer: Yageo; Voltage Rating: 200V; Temperature Coefficient: 100ppm/degreesC; Power Rating: 250mW; Case Code (Metric): 3216; Composition: ThickFilm; Lead Free: LeadFree; Max Operating Temperature: 155degC; Case/Package: 1206; Min Operating Temperature: -55degC; Depth: 1.6mm; RoHSCompliant: true; Datasheet URL: http://www.yageo.com/NewPortal/yageodocoutput?fileName=/pdf/R-Chip/PYu-RC_Group_51_RoHS_L_5.pdf; Datasheet Version: Rev. 5, 10/2016; Package Reference: 1206.0; Packaging: TapeandReel; Manufacturer URL: http://www.yageo.com/; Tolerance: 1%; Height: 0.55mm; REACH SVHC: NoSVHC; Case Code (Imperial): 1206; Length: 3.1mm; Package Description: 2-Pin Surface Mount Device, Body 3.1 x 1.6 mm; Termination: SMD/SMT
R2 = CMP-03412-020064-2: RES 160kΩ ±1% 0.063W 0402; Manufacturer: Yageo; Max Power Dissipation: 63mW; Temperature Coefficient: 100ppm/°C; Voltage Rating: 50V; Series: AC; Resistor Type: Thick Film; RoHS Compliant: Yes; Tolerance: 1%; Number of Terminations: 2; Case Code (Imperial): 0402; Case/Package: 0402; Features: Moisture Resistant; Max Operating Temperature: 155°C; Min Operating Temperature: -55°C; Length: 0.039inch; Case Code (Metric): 1005; Height: 0.015inch; Width: 0.02inch; Packaging: Tape and Reel; Supplier: Digikey; Supplier Part Number: YAG5635CT-ND; Manufacturer Part Number: AC0402FR-07160KL; RoHS: Yes; Category: Chip SMD Resistors; Stock: 26014; Pricing: 1=0.1, 10=0.009, 100=0.0071, 1000=0.0051, 2500=0.00407 (USD); ComponentLink1URL: https://datasheet.octopart.com/AC0402FR-07160KL-Yageo-datasheet-166720450.pdf?src-supplier=Future+Electronics; ComponentLink1Description: https://datasheet.octopart.com/AC0402FR-07160KL-Yageo-datasheet-166720450.pdf?src-supplier=Future+Electronics; ComponentLink2URL: https://www.yageo.com/upload/media/product/productsearch/datasheet/rchip/PYu-AC_51_RoHS_L_7.pdf?src-supplier=Digikey; ComponentLink2Description: https://www.yageo.com/upload/media/product/productsearch/datasheet/rchip/PYu-AC_51_RoHS_L_7.pdf?src-supplier=Digikey; ComponentLink3URL: http://www.yageo.com/NewPortal/yageodocoutput?fileName=/pdf/R-Chip/PYu-AC_51_RoHS_L_6.pdf&src-supplier=Digikey; ComponentLink3Description: http://www.yageo.com/NewPortal/yageodocoutput?fileName=/pdf/R-Chip/PYu-AC_51_RoHS_L_6.pdf&src-supplier=Digikey
U3 = CMP-0246-00392-2: IC REG BOOST ADJ 400MA TSOT23-5; Manufacturer: Maxim; Max Output Voltage: 5.5V; Efficiency: 90%; Max Output Current: 150mA; Number of Outputs: 1; Min Input Voltage: 800mV; Output Type: Adjustable; Min Output Voltage: 2V; Synchronous Rectifier: Yes; Mount: Surface Mount; Series: -; Packaging: Tape and Reel; Radiation Hardening: No; Package Quantity: 1; Number of Pins: 5; Operating Supply Voltage: 5.5V; Case/Package: SOT-23-5; Max Input Voltage: 5.5V; Output Current: 150mA; Min Operating Temperature: -40°C; Output Voltage: 5.5V; Lead Free: Lead Free; Topology: Boost; Max Operating Temperature: 85°C; RoHS Compliant: Yes; Supplier: Digikey; Supplier Part Number: MAX1722EZK+TCT-ND; Manufacturer Part Number: MAX1722EZK+T; RoHS: Yes; Category: Voltage Regulators - Switching; Stock: 3635; Pricing: 1=6.07, 10=4, 25=3.46, 100=2.8487, 250=2.54868, 500=2.36412, 1000=2.325 (USD); ComponentLink1URL: https://datasheet.ciiva.com/2028/max1722-max1724-2028357.pdf?src-supplier=Digikey; ComponentLink1Description: https://datasheet.ciiva.com/2028/max1722-max1724-2028357.pdf?src-supplier=Digikey; ComponentLink2URL: https://datasheet.ciiva.com/2028/max1722-max1724-2028358.pdf?src-supplier=Digikey; ComponentLink2Description: https://datasheet.ciiva.com/2028/max1722-max1724-2028358.pdf?src-supplier=Digikey; ComponentLink3URL: https://datasheet.ciiva.com/2028/max1722-max1724-2028359.pdf?src-supplier=Digikey; ComponentLink3Description: https://datasheet.ciiva.com/2028/max1722-max1724-2028359.pdf?src-supplier=Digikey

## Nets that join several sheets
GND: Main (23 pins), PPG (16 pins), Boost (5 pins)
3V3: Main (12 pins), PPG (D4.2 D9.2 D12.2 DS1.1), Boost (C6.1 C7.1 R1.2 U3.4)
GPIO0: Main (U1.72), PPG (U2.1)
GPIO1: Main (U1.71), PPG (U2.2)
I2C3_SCL: Main (U1.14 U4.13 U7.1), PPG (U2.27)
I2C3_SDA: Main (U1.18 U4.14 U7.6), PPG (U2.28)
Vin: PPG (7 pins), Boost (5 pins)